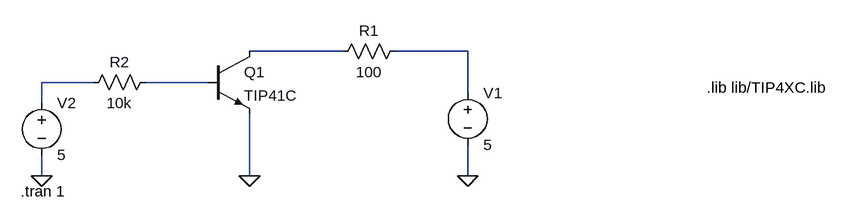
[diagram p0: schematic teste_bjt.asc]
teste_bjt.asc, the LTspice schematic file:
Version 4.1
SHEET 1 880 1432
WIRE -224 1200 -368 1200
WIRE -32 1200 -144 1200
WIRE -608 1248 -688 1248
WIRE -432 1248 -528 1248
WIRE -32 1264 -32 1200
WIRE -688 1280 -688 1248
WIRE -688 1392 -688 1360
WIRE -368 1392 -368 1296
WIRE -32 1392 -32 1344
FLAG -368 1392 0
FLAG -32 1392 0
FLAG -688 1392 0
SYMBOL npn -432 1200 R0
SYMATTR InstName Q1
SYMATTR Value TIP41C
SYMBOL voltage -32 1248 R0
WINDOW 123 0 0 Left 0
WINDOW 39 0 0 Left 0
SYMATTR InstName V1
SYMATTR Value 5
SYMBOL res -128 1184 R90
WINDOW 0 0 56 VBottom 2
WINDOW 3 32 56 VTop 2
SYMATTR InstName R1
SYMATTR Value 100
SYMBOL res -512 1232 R90
WINDOW 0 0 56 VBottom 2
WINDOW 3 32 56 VTop 2
SYMATTR InstName R2
SYMATTR Value 10k
SYMBOL voltage -688 1264 R0
WINDOW 123 0 0 Left 0
WINDOW 39 0 0 Left 0
SYMATTR InstName V2
SYMATTR Value 5
TEXT 336 1256 Left 2 !.lib lib/TIP4XC.lib
TEXT -720 1416 Left 2 !.tran 1

The netlist it stands for:
* teste_bjt.asc
Q1 N001 N004 0 0 TIP41C
V1 N002 0 5
R1 N002 N001 100
R2 N004 N003 10k
V2 N003 0 5
.model NPN NPN
.model PNP PNP
.lib standard.bjt
.lib lib/TIP4XC.lib
.tran 1
.backanno
.end